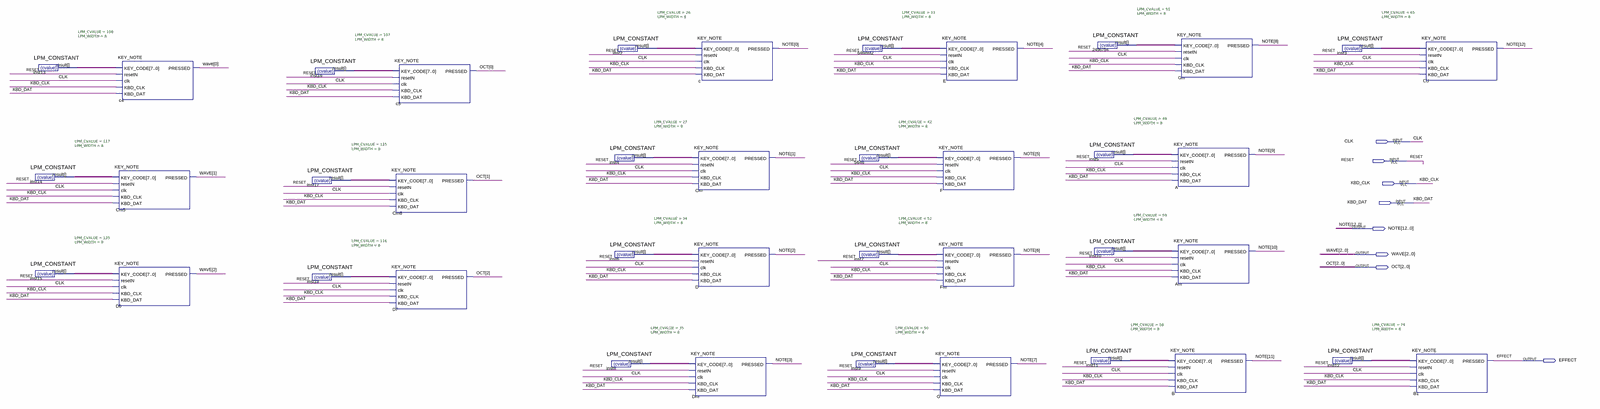
[diagram p0: schematic sheet, whole]
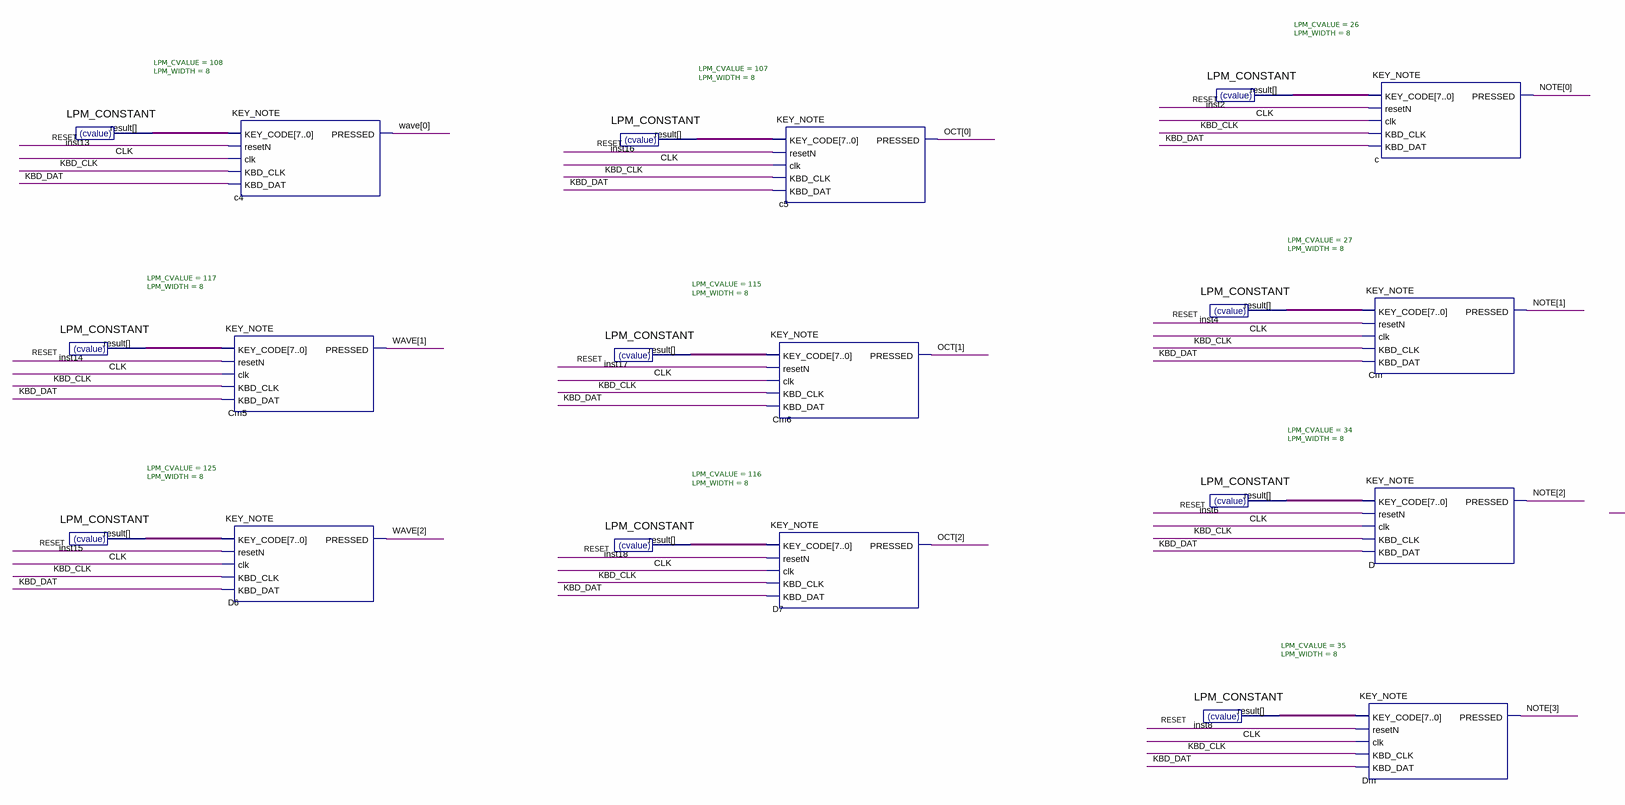
[diagram p1: schematic sheet, left part]
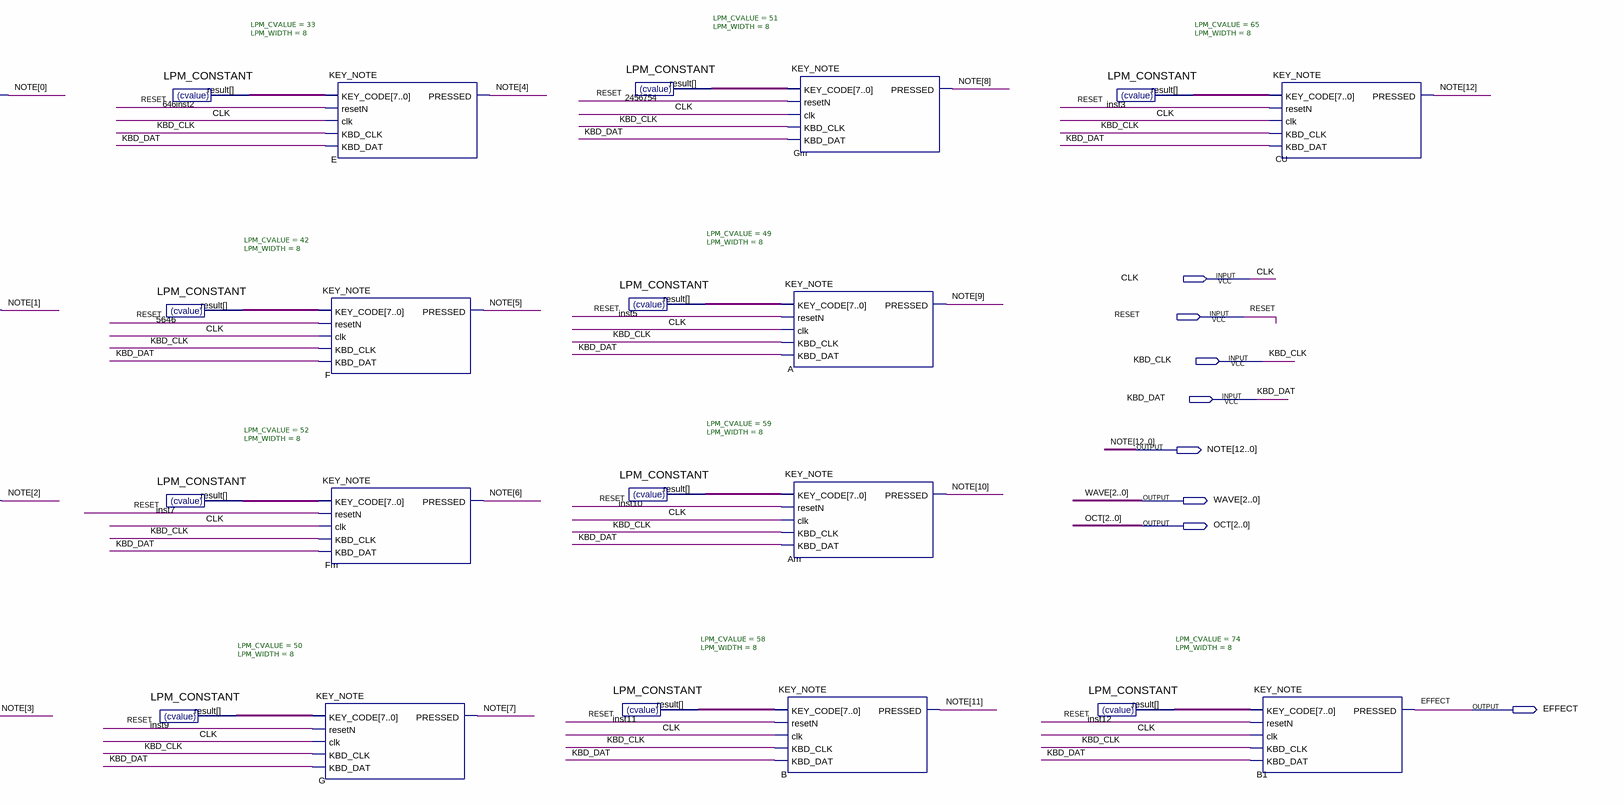
[diagram p2: schematic sheet, right part]
// Quartus schematic KBD_MOD.bdf as structural Verilog: 40 symbols, 8 pins
module KBD_MOD (
  input  CLK,
  input  RESET,
  input  KBD_CLK,
  input  KBD_DAT,
  output [12:0] NOTE,
  output [2:0] WAVE,
  output [2:0] OCT,
  output EFFECT
);

  wire [7:0] inst2_result, inst3_result, inst4_result, inst5_result, inst6_result, inst7_result,
       inst8_result, inst9_result, inst10_result, inst11_result, inst12_result, inst13_result, inst14_result,
       inst15_result, inst16_result, inst17_result, inst18_result, n646inst2_result, n5646_result,
       n2456754_result;

  LPM_CONSTANT #(.LPM_CVALUE(108), .LPM_WIDTH(8)) inst13 (.result(inst13_result));
  LPM_CONSTANT #(.LPM_CVALUE(117), .LPM_WIDTH(8)) inst14 (.result(inst14_result));
  LPM_CONSTANT #(.LPM_CVALUE(125), .LPM_WIDTH(8)) inst15 (.result(inst15_result));
  KEY_NOTE c4 (
    .KEY_CODE(inst13_result), .resetN(RESET), .clk(CLK), .KBD_CLK(KBD_CLK), .KBD_DAT(KBD_DAT),
    .PRESSED(WAVE[0]));
  KEY_NOTE Cm5 (
    .KEY_CODE(inst14_result), .resetN(RESET), .clk(CLK), .KBD_CLK(KBD_CLK), .KBD_DAT(KBD_DAT),
    .PRESSED(WAVE[1]));
  KEY_NOTE D6 (
    .KEY_CODE(inst15_result), .resetN(RESET), .clk(CLK), .KBD_CLK(KBD_CLK), .KBD_DAT(KBD_DAT),
    .PRESSED(WAVE[2]));
  LPM_CONSTANT #(.LPM_CVALUE(107), .LPM_WIDTH(8)) inst16 (.result(inst16_result));
  LPM_CONSTANT #(.LPM_CVALUE(115), .LPM_WIDTH(8)) inst17 (.result(inst17_result));
  LPM_CONSTANT #(.LPM_CVALUE(116), .LPM_WIDTH(8)) inst18 (.result(inst18_result));
  KEY_NOTE c5 (
    .KEY_CODE(inst16_result), .resetN(RESET), .clk(CLK), .KBD_CLK(KBD_CLK), .KBD_DAT(KBD_DAT),
    .PRESSED(OCT[0]));
  KEY_NOTE Cm6 (
    .KEY_CODE(inst17_result), .resetN(RESET), .clk(CLK), .KBD_CLK(KBD_CLK), .KBD_DAT(KBD_DAT),
    .PRESSED(OCT[1]));
  KEY_NOTE D7 (
    .KEY_CODE(inst18_result), .resetN(RESET), .clk(CLK), .KBD_CLK(KBD_CLK), .KBD_DAT(KBD_DAT),
    .PRESSED(OCT[2]));
  LPM_CONSTANT #(.LPM_CVALUE(26), .LPM_WIDTH(8)) inst2 (.result(inst2_result));
  LPM_CONSTANT #(.LPM_CVALUE(27), .LPM_WIDTH(8)) inst4 (.result(inst4_result));
  LPM_CONSTANT #(.LPM_CVALUE(34), .LPM_WIDTH(8)) inst6 (.result(inst6_result));
  LPM_CONSTANT #(.LPM_CVALUE(35), .LPM_WIDTH(8)) inst8 (.result(inst8_result));
  KEY_NOTE c (
    .KEY_CODE(inst2_result), .resetN(RESET), .clk(CLK), .KBD_CLK(KBD_CLK), .KBD_DAT(KBD_DAT),
    .PRESSED(NOTE[0]));
  KEY_NOTE Cm (
    .KEY_CODE(inst4_result), .resetN(RESET), .clk(CLK), .KBD_CLK(KBD_CLK), .KBD_DAT(KBD_DAT),
    .PRESSED(NOTE[1]));
  KEY_NOTE D (
    .KEY_CODE(inst6_result), .resetN(RESET), .clk(CLK), .KBD_CLK(KBD_CLK), .KBD_DAT(KBD_DAT),
    .PRESSED(NOTE[2]));
  KEY_NOTE Dm (
    .KEY_CODE(inst8_result), .resetN(RESET), .clk(CLK), .KBD_CLK(KBD_CLK), .KBD_DAT(KBD_DAT),
    .PRESSED(NOTE[3]));
  LPM_CONSTANT #(.LPM_CVALUE(33), .LPM_WIDTH(8)) u_646inst2 (.result(n646inst2_result));
  LPM_CONSTANT #(.LPM_CVALUE(42), .LPM_WIDTH(8)) u_5646 (.result(n5646_result));
  LPM_CONSTANT #(.LPM_CVALUE(52), .LPM_WIDTH(8)) inst7 (.result(inst7_result));
  LPM_CONSTANT #(.LPM_CVALUE(50), .LPM_WIDTH(8)) inst9 (.result(inst9_result));
  KEY_NOTE G (
    .KEY_CODE(inst9_result), .resetN(RESET), .clk(CLK), .KBD_CLK(KBD_CLK), .KBD_DAT(KBD_DAT),
    .PRESSED(NOTE[7]));
  KEY_NOTE E (
    .KEY_CODE(n646inst2_result), .resetN(RESET), .clk(CLK), .KBD_CLK(KBD_CLK), .KBD_DAT(KBD_DAT),
    .PRESSED(NOTE[4]));
  KEY_NOTE F (
    .KEY_CODE(n5646_result), .resetN(RESET), .clk(CLK), .KBD_CLK(KBD_CLK), .KBD_DAT(KBD_DAT),
    .PRESSED(NOTE[5]));
  KEY_NOTE Fm (
    .KEY_CODE(inst7_result), .resetN(RESET), .clk(CLK), .KBD_CLK(KBD_CLK), .KBD_DAT(KBD_DAT),
    .PRESSED(NOTE[6]));
  LPM_CONSTANT #(.LPM_CVALUE(49), .LPM_WIDTH(8)) inst5 (.result(inst5_result));
  LPM_CONSTANT #(.LPM_CVALUE(59), .LPM_WIDTH(8)) inst10 (.result(inst10_result));
  LPM_CONSTANT #(.LPM_CVALUE(58), .LPM_WIDTH(8)) inst11 (.result(inst11_result));
  LPM_CONSTANT #(.LPM_CVALUE(51), .LPM_WIDTH(8)) u_2456754 (.result(n2456754_result));
  KEY_NOTE Gm (
    .KEY_CODE(n2456754_result), .resetN(RESET), .clk(CLK), .KBD_CLK(KBD_CLK), .KBD_DAT(KBD_DAT),
    .PRESSED(NOTE[8]));
  KEY_NOTE A (
    .KEY_CODE(inst5_result), .resetN(RESET), .clk(CLK), .KBD_CLK(KBD_CLK), .KBD_DAT(KBD_DAT),
    .PRESSED(NOTE[9]));
  KEY_NOTE Am (
    .KEY_CODE(inst10_result), .resetN(RESET), .clk(CLK), .KBD_CLK(KBD_CLK), .KBD_DAT(KBD_DAT),
    .PRESSED(NOTE[10]));
  KEY_NOTE B (
    .KEY_CODE(inst11_result), .resetN(RESET), .clk(CLK), .KBD_CLK(KBD_CLK), .KBD_DAT(KBD_DAT),
    .PRESSED(NOTE[11]));
  LPM_CONSTANT #(.LPM_CVALUE(65), .LPM_WIDTH(8)) inst3 (.result(inst3_result));
  LPM_CONSTANT #(.LPM_CVALUE(74), .LPM_WIDTH(8)) inst12 (.result(inst12_result));
  KEY_NOTE CU (
    .KEY_CODE(inst3_result), .resetN(RESET), .clk(CLK), .KBD_CLK(KBD_CLK), .KBD_DAT(KBD_DAT),
    .PRESSED(NOTE[12]));
  KEY_NOTE B1 (
    .KEY_CODE(inst12_result), .resetN(RESET), .clk(CLK), .KBD_CLK(KBD_CLK), .KBD_DAT(KBD_DAT),
    .PRESSED(EFFECT));
endmodule
